# Altium schematic sheet temp1.robcon.powerboard.sche.SchDoc
size A4; SheetNumber: 1; SheetTotal: 2
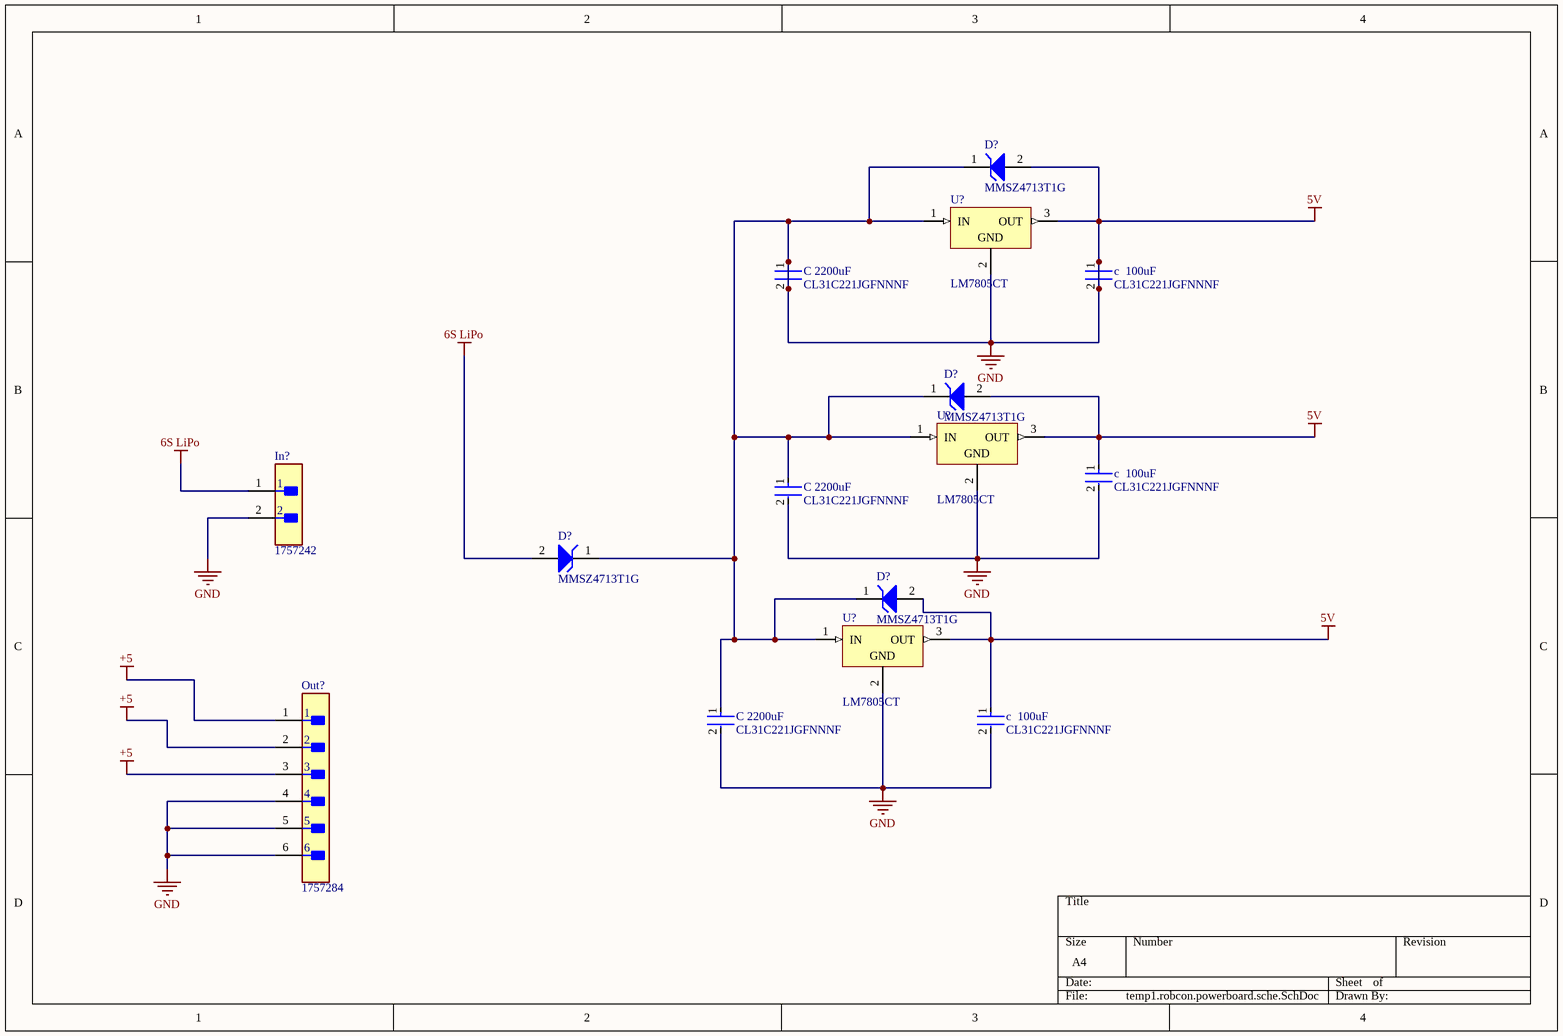
[diagram p0: temp1.robcon.powerboard.sche.SchDoc]

## Parts
(Parts that share a designator on the sheet are numbered #1, #2 ... from top to bottom, then left to right.)
c_100uF#1  CL31C221JGFNNNF  [FP-CL31-IPC_C]
c_100uF#2  CL31C221JGFNNNF  [FP-CL31-IPC_C]
c_100uF#3  CL31C221JGFNNNF  [FP-CL31-IPC_C]
C_2200uF#1  CL31C221JGFNNNF  [FP-CL31-IPC_B]
C_2200uF#2  CL31C221JGFNNNF  [FP-CL31-IPC_B]
C_2200uF#3  CL31C221JGFNNNF  [FP-CL31-IPC_B]
D?#1  MMSZ4713T1G  [ONSC-SOD-123-2-425-04_V]
D?#2  MMSZ4713T1G  [ONSC-SOD-123-2-425-04_V]
D?#3  MMSZ4713T1G  [ONSC-SOD-123-2-425-04_V]
D?#4  MMSZ4713T1G  [ONSC-SOD-123-2-425-04_V]
In?  1757242  [FP-1757242-MFG]
Out?  1757284  [FP-1757284-MFG]
U?#1  LM7805CT  [FAIR-TO-220-3]
U?#2  LM7805CT  [FAIR-TO-220-3]
U?#3  LM7805CT  [FAIR-TO-220-3]

## Nets
5V: c_100uF#1.1 c_100uF#1.2 c_100uF#2.1 c_100uF#2.2 c_100uF#3.1 c_100uF#3.2 C_2200uF#1.1 C_2200uF#1.2 C_2200uF#2.1 C_2200uF#2.2 C_2200uF#3.1 C_2200uF#3.2 D?#1.1(K) D?#1.2(A) D?#2.1(K) D?#2.2(A) D?#3.1(K) D?#4.1(K) D?#4.2(A) In?.2 Out?.4 Out?.5 Out?.6 U?#1.1(IN) U?#1.2(GND) U?#1.3(OUT) U?#2.1(IN) U?#2.2(GND) U?#2.3(OUT) U?#3.1(IN) U?#3.2(GND) U?#3.3(OUT)  [also labelled GND]
6S LiPo: D?#3.2(A) In?.1
+5: Out?.1 Out?.2 Out?.3

## Library data of the parts
c_100uF#1-c_100uF#3 = CMP-13271-001211-1: Cap Ceramic 100uF 500V C0G ±5% SMD 1206 +125°C Embossed T/R; Tolerance: 5%; Voltage Rating (DC): 500V; Depth: 1.6mm; Capacitance: 100uF; Max Operating Temperature: 125°C; Width: 0.063inch; Radiation Hardening: No; Thickness: 0.055inch; Packaging: Tape and Reel; Height: 1.25mm; Case/Package: 1206; Package Quantity: 10000; Dielectric: C0G; Mount: Surface Mount; Voltage Rating: 500V; Min Operating Temperature: -55°C; Length: 3.2mm
C_2200uF#1-C_2200uF#3 = CMP-13271-001211-1: Cap Ceramic 2200uF 500V C0G ±5% SMD 1206 +125°C Embossed T/R; Tolerance: 5%; Voltage Rating (DC): 500V; Depth: 1.6mm; Capacitance: 2200uF; Max Operating Temperature: 125°C; Width: 0.063inch; Radiation Hardening: No; Thickness: 0.055inch; Packaging: Tape and Reel; Height: 1.25mm; Case/Package: 1206; Package Quantity: 10000; Dielectric: C0G; Mount: Surface Mount; Voltage Rating: 500V; Min Operating Temperature: -55°C; Length: 3.2mm
D?#1-D?#4 = CMP-1060-00318-1: Zener Voltage Regulator, 500 mW, 2-Pin SOD-123, Pb-Free, Tape and Reel; Manufacturer: On Semiconductor; P Max (W): 0.5; VZ Typ (V): 30; PackageVersion: Rev. G, 10/2009; Mounting Technology: Surface Mount; ComponentLink3URL: http://www.onsemi.com/pub_link/Collateral/425-04.PDF; ComponentLink3Description: Package Specification; ComponentLink1Description: Manufacturer URL; PackageReference: SOD-123-2-425-04; ComponentLink2Description: Datasheet; DatasheetVersion: Rev. 9; RoHS: Pb-Free; Packing: Tape and Reel; ComponentLink2URL: http://www.onsemi.com/pub_link/Collateral/MMSZ4678T1-D.PDF; ComponentLink1URL: http://www.onsemi.com/; PartNumber: MMSZ4713T1G; PackageDescription: 2-Pin SOD, Body 1.6 x 2.69 mm
In? = CMP-09399-000010-1: TERM BLOCK HDR 2POS 90DEG 5.08MM; Number of Poles: 2; Voltage Rating (DC): 320V; Number of Levels: 1; Voltage Rating: 250V; Current: 15A; Gender: Male; Current Rating: 12A; Voltage: 300V; Approvals: UL; Connector Type: Plug; Package Quantity: 50; Weight: 5.396916oz; Mount: Through Hole; Lead Free: Lead Free; Depth: 12mm; Contact Plating: Tin; Housing Material: PBT; Color: Grey; REACH SVHC: No SVHC; Number of Contacts: 2; Flammability Rating: UL94 V-0; Length: 12.16mm; Housing Color: Green; RoHS Compliant: Yes; Contact Material: Tin; Height: 12.08mm; Orientation: Right Angle; Termination: Solder; Pitch: 5.08mm; Number of Positions: 2; Packaging: Bulk; Number of Rows: 1; Number of Positions Per Level: 2; Width: 12.1mm; Max Current Rating: 12A; Series: MSTBA
Out? = CMP-09399-000007-1: TERM BLOCK HDR 6POS 90DEG 5.08MM; Gender: Male; Voltage Rating: 250V; Max Current Rating: 12A; Number of Positions: 6; Current: 15A; Approvals: UL; Number of Levels: 1; Voltage: 300V; Voltage Rating (DC): 320V; Connector Type: Plug; Termination: Solder; Weight: 5.396916oz; Flammability Rating: UL94 V-0; Packaging: Bulk; Package Quantity: 50; Contact Plating: Tin; REACH SVHC: No SVHC; Color: Grey; Current Rating: 12A; Mount: Through Hole; Height: 12.1mm; Number of Rows: 1; Number of Contacts: 6; Housing Material: Polybutylene; Series: MSTBA; Pitch: 5.08mm; RoHS Compliant: Yes; Orientation: Right Angle; Housing Color: Green; Length: 32.48mm; Number of Positions Per Level: 6; Width: 32.4mm; Depth: 12mm; Lead Free: Lead Free; Contact Material: Tin; Number of Poles: 6
U?#1-U?#3 = CMP-2000-04938-1: Positive Voltage Regulator, 5 V, 1 A, -40 to 125 degC, 3-Pin TO-220, RoHS, Tube; Manufacturer: FairchildSemiconductor; Maximum Input Voltage: 35V; Maximum Quiescent Current: 8mA; Load Regulation: 100mV; Maximum Output Current: 2.2(Typ)A; Output Type: Fixed; Typical Dropout Voltage @ Current: 2@1AV; Rad Hard: No; Output Voltage: 5V; Accuracy: ±4%; Number of Outputs: 1; Category: LinearRegulator; Package Description: 3-Pin Through Hole Device, Body 10 x 4.5 mm, Pitch 2.54 mm; Packaging: Rail/Tube; Mounting: ThroughHole; Polarity: Positive; Manufacturer URL: https://www.fairchildsemi.com/; Line Regulation: 100mV; Datasheet Version: Aug-12; Datasheet URL: https://datasheet.ciiva.com/26904/lm7805ct-26904988.pdf; Package Reference: TO-220; Package URL: https://www.fairchildsemi.com/package-drawings/TO/TO220B03.pdf; Package: 3TO-220AB; Operating Temperature: -40to125degC; Type: Linear